# EAGLE schematic power (EAGLE 9.6.2)
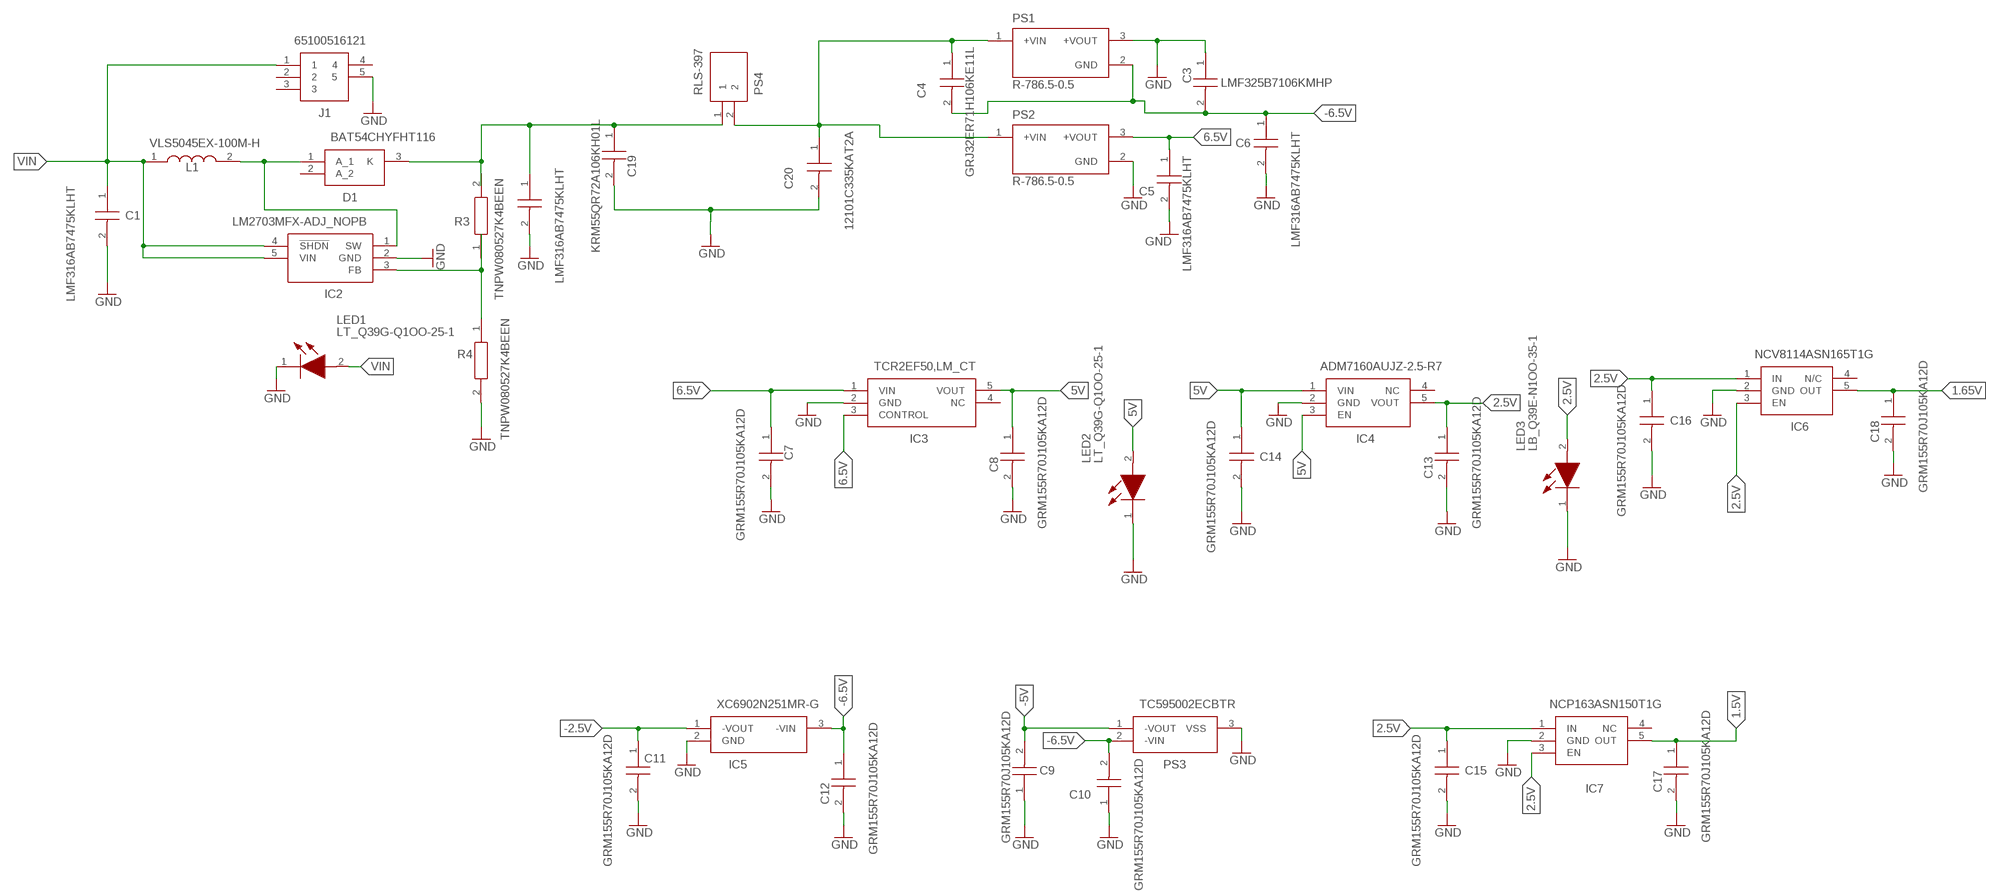
[diagram p0: schematic, sheet 1]

## Parts
C1  LMF316AB7475KLHT  [CAPC3216X180N]
C2  LMF316AB7475KLHT  [CAPC3216X180N]
C3  LMF325B7106KMHP  [CAPC3225X270N]
C4  GRJ32ER71H106KE11L  [CAPC3225X280N]
C5  LMF316AB7475KLHT  [CAPC3216X180N]
C6  LMF316AB7475KLHT  [CAPC3216X180N]
C7  GRM155R70J105KA12D  [CAPC1005X55N]
C8  GRM155R70J105KA12D  [CAPC1005X55N]
C9  GRM155R70J105KA12D  [CAPC1005X55N]
C10  GRM155R70J105KA12D  [CAPC1005X55N]
C11  GRM155R70J105KA12D  [CAPC1005X55N]
C12  GRM155R70J105KA12D  [CAPC1005X55N]
C13  GRM155R70J105KA12D  [CAPC1005X55N]
C14  GRM155R70J105KA12D  [CAPC1005X55N]
C15  GRM155R70J105KA12D  [CAPC1005X55N]
C16  GRM155R70J105KA12D  [CAPC1005X55N]
C17  GRM155R70J105KA12D  [CAPC1005X55N]
C18  GRM155R70J105KA12D  [CAPC1005X55N]
C19  KRM55QR72A106KH01L  [CAPC6153X390N]
C20  12101C335KAT2A  [CAPC3325X279N]
D1  BAT54CHYFHT116  [SOT95P240X115-3N]
IC2  LM2703MFX-ADJ_NOPB  [SOT95P280X145-5N]
IC3  TCR2EF50,LM_CT  [TCR2EF50LMCT]
IC4  ADM7160AUJZ-2.5-R7  [SOT95P280X100-5N]
IC5  XC6902N251MR-G  [SOT95P280X130-3N]
IC6  NCV8114ASN165T1G  [SOT95P275X110-5N]
IC7  NCP163ASN150T1G  [SOT95P280X145-5N]
J1  65100516121  [65100516121]
L1  VLS5045EX-100M-H  [VLS5045EX330M]
LED1  LT_Q39G-Q1OO-25-1  [LEDC1608X40N]
LED2  LT_Q39G-Q1OO-25-1  [LEDC1608X40N]
LED3  LB_Q39E-N1OO-35-1  [LEDC1608X40N]
PS1  R-786.5-0.5  [CONV_R-786.5-0.5]
PS2  R-786.5-0.5  [CONV_R-786.5-0.5]
PS3  TC595002ECBTR  [SOT95P275X130-3N]
PS4  RLS-397  [RLS397]
R3  TNPW080527K4BEEN  [RESC2012X55N]
R4  TNPW080527K4BEEN  [RESC2012X55N]

## Nets
1.5V: C17.1 IC7.5(OUT)
1.65V: C18.1 IC6.5(OUT)
2.5V: C13.1 C15.1 C16.1 IC4.5(VOUT) IC6.1(IN) IC6.3(EN) IC7.1(IN) IC7.3(EN) LED3.2(A)
5V: C8.1 C14.1 IC3.5(VOUT) IC4.1(VIN) IC4.3(EN) LED2.2(A)
6.5V: C5.1 C7.1 IC3.1(VIN) IC3.3(CONTROL) PS2.3(+VOUT)
-2.5V: C11.1 IC5.1(-VOUT)
-5V: C9.2 PS3.1(-VOUT)
-6.5V: C3.2 C4.2 C6.1 C10.2 C12.1 IC5.3(-VIN) PS1.2(GND) PS3.2(-VIN)
GND: C1.2 C2.2 C3.1 C5.2 C6.2 C7.2 C8.2 C9.1 C10.1 C11.2 C12.2 C13.2 C14.2 C15.2 C16.2 C17.2 C18.2 C19.2 C20.2 IC2.2(GND) IC3.2(GND) IC4.2(GND) IC5.2(GND) IC6.2(GND) IC7.2(GND) J1.5 LED1.1(K) LED2.1(K) LED3.1(K) PS1.3(+VOUT) PS2.2(GND) PS3.3(VSS) R4.2
IN: C2.1 C19.1 D1.3(K) PS4.1 R3.2
N$2: IC2.3(FB) R3.1 R4.1
N$7: C4.1 C20.1 PS1.1(+VIN) PS2.1(+VIN) PS4.2
N$8: D1.1(A_1) IC2.1(SW) L1.2
VIN: C1.1 IC2.4(!SHDN) IC2.5(VIN) J1.1 L1.1 LED1.2(A)
Unconnected: D1.2(A_2) IC3.4(NC) IC4.4(NC) IC6.4(N/C) IC7.4(NC) J1.2 J1.3 J1.4

## Library data of the parts
C1 C2 C5 C6 = SamacSys_Parts:LMF316AB7475KLHT: Multilayer Ceramic Capacitors MLCC - SMD/SMT 1206 10VDC 4.7uF 10% X7R AEC-Q200 Source: Datasheet <https://4donline.ihs.com/images/VipMasterIC/IC/TAIY/TAIY-S-A0014577573/TAIY-S-A0014577337-1.pdf?hkey=EF798316E3902B6ED9A73243A3159BB0>; DESCRIPTION: Multilayer Ceramic Capacitors MLCC - SMD/SMT 1206 10VDC 4.7uF 10% X7R AEC-Q200; HEIGHT: 1.8mm; MANUFACTURER_NAME: TAIYO YUDEN; MANUFACTURER_PART_NUMBER: LMF316AB7475KLHT; MOUSER_PART_NUMBER: 963-LMF316AB7475KLHT; MOUSER_PRICE-STOCK: https://www.mouser.co.uk/ProductDetail/Taiyo-Yuden/LMF316AB7475KLHT?qs=%252B6g0mu59x7Jucp0YIcNtlw%3D%3D
C3 = SamacSys_Parts:LMF325B7106KMHP: Multilayer Ceramic Capacitors MLCC - SMD/SMT 1210 10VDC 10uF 10% X7R AEC-Q200 Source: Datasheet <https://4donline.ihs.com/images/VipMasterIC/IC/TAIY/TAIY-S-A0010497038/TAIY-S-A0010490867-1.pdf?hkey=6D3A4C79FDBF58556ACFDE234799DDF0>; DESCRIPTION: Multilayer Ceramic Capacitors MLCC - SMD/SMT 1210 10VDC 10uF 10% X7R AEC-Q200; HEIGHT: 2.7mm; MANUFACTURER_NAME: TAIYO YUDEN; MANUFACTURER_PART_NUMBER: LMF325B7106KMHP; MOUSER_PART_NUMBER: 963-LMF325B7106KMHP; MOUSER_PRICE-STOCK: https://www.mouser.co.uk/ProductDetail/Taiyo-Yuden/LMF325B7106KMHP?qs=W%2FMpXkg%252BdQ7tCScIXneZ%2FA%3D%3D
C4 = SamacSys_Parts:GRJ32ER71H106KE11L: Cap Ceramic 10uF 50V X7R 10% Pad SMD 1210 Soft Termination 125C T/R Source: Datasheet <https://componentsearchengine.com/Datasheets/1/GRJ32ER71H106KE11L.pdf>; ARROW_PART_NUMBER: GRJ32ER71H106KE11L; ARROW_PRICE-STOCK: https://www.arrow.com/en/products/grj32er71h106ke11l/murata-manufacturing?region=nac; DESCRIPTION: Cap Ceramic 10uF 50V X7R 10% Pad SMD 1210 Soft Termination 125C T/R; HEIGHT: 2.8mm; MANUFACTURER_NAME: Murata Electronics; MANUFACTURER_PART_NUMBER: GRJ32ER71H106KE11L; MOUSER_PART_NUMBER: 81-GRJ32ER71H106KE1L; MOUSER_PRICE-STOCK: https://www.mouser.co.uk/ProductDetail/Murata-Electronics/GRJ32ER71H106KE11L?qs=Mkt%2FZhxPIiRCGrZ4HFiKZA%3D%3D
C7-C18 = SamacSys_Parts:GRM155R70J105KA12D: Multilayer Ceramic Capacitors MLCC - SMD/SMT 0402 1.0uF 6.3volts *Derate Voltage/Temp Source: Datasheet <https://psearch.en.murata.com/capacitor/product/GRM155R70J105KA12#.html>; ARROW_PART_NUMBER: GRM155R70J105KA12D; ARROW_PRICE-STOCK: https://www.arrow.com/en/products/grm155r70j105ka12d/murata-manufacturing?region=nac; DESCRIPTION: Multilayer Ceramic Capacitors MLCC - SMD/SMT 0402 1.0uF 6.3volts *Derate Voltage/Temp; HEIGHT: 0.55mm; MANUFACTURER_NAME: Murata Electronics; MANUFACTURER_PART_NUMBER: GRM155R70J105KA12D; MOUSER_PART_NUMBER: 81-GRM155R70J105KA2D; MOUSER_PRICE-STOCK: https://www.mouser.co.uk/ProductDetail/Murata-Electronics/GRM155R70J105KA12D?qs=OXzh9Ga2KBHWfvlODrgZnQ%3D%3D
C19 = SamacSys_Parts:KRM55QR72A106KH01L: Multilayer Ceramic Capacitors MLCC - SMD/SMT Source: Datasheet <https://psearch.en.murata.com/capacitor/product/KRM55QR72A106KH01#.html>; ARROW_PART_NUMBER: KRM55QR72A106KH01L; ARROW_PRICE-STOCK: https://www.arrow.com/en/products/krm55qr72a106kh01l/murata-manufacturing?region=nac; DESCRIPTION: Multilayer Ceramic Capacitors MLCC - SMD/SMT; HEIGHT: 3.9mm; MANUFACTURER_NAME: Murata Electronics; MANUFACTURER_PART_NUMBER: KRM55QR72A106KH01L; MOUSER_PART_NUMBER: 81-KRM55QR72A106KH1L; MOUSER_PRICE-STOCK: https://www.mouser.co.uk/ProductDetail/Murata-Electronics/KRM55QR72A106KH01L?qs=qkDYIeTQ%252BElto0fJu%2F86Vw%3D%3D
C20 = SamacSys_Parts:12101C335KAT2A: Multilayer Ceramic Capacitors MLCC - SMD/SMT 100V 3.3uF X7R 1210 10% Source: Datasheet <https://componentsearchengine.com/Datasheets/2/12101C335KAT2A.pdf>; DESCRIPTION: Multilayer Ceramic Capacitors MLCC - SMD/SMT 100V 3.3uF X7R 1210 10%; HEIGHT: 2.79mm; MANUFACTURER_NAME: AVX; MANUFACTURER_PART_NUMBER: 12101C335KAT2A; MOUSER_PART_NUMBER: 581-12101C335KAT2A; MOUSER_PRICE-STOCK: https://www.mouser.co.uk/ProductDetail/AVX/12101C335KAT2A?qs=t3bE0qb%2FqELbFuOKr%2F10pA%3D%3D
D1 = SamacSys_Parts:BAT54CHYFHT116: Schottky Diodes & Rectifiers SCHOTTKY BARRIER DIODE Source: Datasheet <https://4donline.ihs.com/images/VipMasterIC/IC/ROHM/ROHM-S-A0010595071/ROHM-S-A0010666907-1.pdf?hkey=EF798316E3902B6ED9A73243A3159BB0>; DESCRIPTION: Schottky Diodes & Rectifiers SCHOTTKY BARRIER DIODE; HEIGHT: 1.15mm; MANUFACTURER_NAME: ROHM Semiconductor; MANUFACTURER_PART_NUMBER: BAT54CHYFHT116; MOUSER_PART_NUMBER: 755-BAT54CHYFHT116; MOUSER_PRICE-STOCK: https://www.mouser.co.uk/ProductDetail/ROHM-Semiconductor/BAT54CHYFHT116?qs=QNEnbhJQKvbxVoFekP9UeQ%3D%3D
IC2 = SamacSys_Parts:LM2703MFX-ADJ_NOPB: Micropower Step-Up DC/DC Converter with 350mA Peak Current Limit Source: Datasheet <http://www.ti.com/lit/gpn/lm2703>; ARROW_PART_NUMBER: LM2703MFX-ADJ/NOPB; ARROW_PRICE-STOCK: https://www.arrow.com/en/products/lm2703mfx-adjnopb/texas-instruments; DESCRIPTION: Micropower Step-Up DC/DC Converter with 350mA Peak Current Limit; HEIGHT: 1.45mm; MANUFACTURER_NAME: Texas Instruments; MANUFACTURER_PART_NUMBER: LM2703MFX-ADJ/NOPB; MOUSER_PART_NUMBER: 926-LM2703MFXADJNOPB; MOUSER_PRICE-STOCK: https://www.mouser.com/Search/Refine.aspx?Keyword=926-LM2703MFXADJNOPB
IC3 = SamacSys_Parts:TCR2EF50,LM_CT: LDO Voltage Regulators 200mA LDO, Vout=5.0V, Dropout=180mV, Iq=35uA, PSRR=73dB, in SOT-25 (SMV) package Source: Datasheet <https://toshiba.semicon-storage.com/info/docget.jsp?did=13794&prodName=TCR2EF50>; DESCRIPTION: LDO Voltage Regulators 200mA LDO, Vout=5.0V, Dropout=180mV, Iq=35uA, PSRR=73dB, in SOT-25 (SMV) package; HEIGHT: 1.4mm; MANUFACTURER_NAME: Toshiba; MANUFACTURER_PART_NUMBER: TCR2EF50,LM(CT; MOUSER_PART_NUMBER: 757-TCR2EF50LMCT; MOUSER_PRICE-STOCK: https://www.mouser.co.uk/ProductDetail/Toshiba/TCR2EF50LMCT?qs=bZr6mbWTK5m4vMduq2OXCA%3D%3D
IC4 = SamacSys_Parts:ADM7160AUJZ-2.5-R7: LDO Voltage Regulators 200mA LDO 25Vout Source: Datasheet <https://componentsearchengine.com/Datasheets/1/ADM7160AUJZ-2.5-R7.pdf>; DESCRIPTION: LDO Voltage Regulators 200mA LDO 25Vout; HEIGHT: 1mm; MANUFACTURER_NAME: Linear Technology; MANUFACTURER_PART_NUMBER: ADM7160AUJZ-2.5-R7; MOUSER_PART_NUMBER: 584-ADM7160AUJZ2.5R7; MOUSER_PRICE-STOCK: https://www.mouser.com/Search/Refine.aspx?Keyword=584-ADM7160AUJZ2.5R7
IC5 = SamacSys_Parts:XC6902N251MR-G: LDO Voltage Regulators Source: Datasheet <http://www.mouser.com/ds/2/760/XC6902-846637.pdf>; DESCRIPTION: LDO Voltage Regulators; HEIGHT: 1.3mm; MANUFACTURER_NAME: Torex; MANUFACTURER_PART_NUMBER: XC6902N251MR-G; MOUSER_PART_NUMBER: 865-XC6902N251MR-G; MOUSER_PRICE-STOCK: https://www.mouser.co.uk/ProductDetail/Torex-Semiconductor/XC6902N251MR-G/?qs=AsjdqWjXhJ97TLkuQPXWBQ%3D%3D
IC6 = SamacSys_Parts:NCV8114ASN165T1G: ONSEMI - NCV8114ASN165T1G - LDO REGULATOR, 300 MA, LOW IQ 1.65V AD Source: Datasheet <https://www.onsemi.com/pub/Collateral/NCV8114-D.PDF>; ARROW_PART_NUMBER: NCV8114ASN165T1G; ARROW_PRICE-STOCK: https://www.arrow.com/en/products/ncv8114asn165t1g/on-semiconductor?region=nac; DESCRIPTION: ONSEMI - NCV8114ASN165T1G - LDO REGULATOR, 300 MA, LOW IQ 1.65V AD; HEIGHT: 1.1mm; MANUFACTURER_NAME: ON Semiconductor; MANUFACTURER_PART_NUMBER: NCV8114ASN165T1G; MOUSER_PART_NUMBER: 863-NCV8114ASN165T1G; MOUSER_PRICE-STOCK: https://www.mouser.co.uk/ProductDetail/onsemi/NCV8114ASN165T1G?qs=PqoDHHvF64%252BWMsY7A2HF3Q%3D%3D
IC7 = SamacSys_Parts:NCP163ASN150T1G: ONSEMI - NCP163ASN150T1G - LDO Voltage Regulator, Fixed, 2.2 V to 5.5 V in, 1.5 V / 250 mA out, SOT23-5 Source: Datasheet <https://www.onsemi.com/pdf/datasheet/ncp163-d.pdf>; DESCRIPTION: ONSEMI - NCP163ASN150T1G - LDO Voltage Regulator, Fixed, 2.2 V to 5.5 V in, 1.5 V / 250 mA out, SOT23-5; HEIGHT: 1.45mm; MANUFACTURER_NAME: ON Semiconductor; MANUFACTURER_PART_NUMBER: NCP163ASN150T1G; MOUSER_PART_NUMBER: 863-NCP163ASN150T1G; MOUSER_PRICE-STOCK: https://www.mouser.co.uk/ProductDetail/onsemi/NCP163ASN150T1G?qs=vLWxofP3U2x6R82l9MbdEQ%3D%3D
J1 = SamacSys_Parts:65100516121: WR-COM USB Connector Mini horizontal SMD Wurth Elektronik WR-COM Series Right Angle SMT Type B Mini USB Connector Receptacle, 30 V ac, 1A Source: Datasheet <http://www.farnell.com/datasheets/2157009.pdf>; DESCRIPTION: WR-COM USB Connector Mini horizontal SMD Wurth Elektronik WR-COM Series Right Angle SMT Type B Mini USB Connector Receptacle, 30 V ac, 1A; HEIGHT: mm; MANUFACTURER_NAME: Wurth Elektronik; MANUFACTURER_PART_NUMBER: 65100516121; MOUSER_PART_NUMBER: 710-65100516121; MOUSER_PRICE-STOCK: https://www.mouser.co.uk/ProductDetail/Wurth-Elektronik/65100516121?qs=rS3zZhy2AQPLyCguT204Og%3D%3D
L1 = SamacSys_Parts:VLS5045EX-100M-H: SMD / SMT Inductors (Coils), L=10?H, L x W x T : Source: Datasheet <https://product.tdk.com/system/files/dam/doc/product/inductor/inductor/smd/catalog/inductor_automotive_power_vls5045ex-h_en.pdf>; ARROW_PART_NUMBER: VLS5045EX-100M-H; ARROW_PRICE-STOCK: https://www.arrow.com/en/products/vls5045ex-100m-h/tdk; DESCRIPTION: SMD / SMT Inductors (Coils), L=10?H, L x W x T :; HEIGHT: 4mm; MANUFACTURER_NAME: TDK; MANUFACTURER_PART_NUMBER: VLS5045EX-100M-H; MOUSER_PART_NUMBER: 810-VLS5045EX-100M-H; MOUSER_PRICE-STOCK: https://www.mouser.co.uk/ProductDetail/TDK/VLS5045EX-100M-H?qs=EBDBlbfErPxDDKYBGzjLDg%3D%3D
LED1 LED2 = SamacSys_Parts:LT_Q39G-Q1OO-25-1: 2.85 V Green LED 1608 (0603) SMD,Osram Opto CHIPLED 0603 LT Q39G-Q1OO-25-1 Source: Datasheet <https://datasheet.datasheetarchive.com/originals/distributors/DKDS41/DSANUWW0036591.pdf>; DESCRIPTION: 2.85 V Green LED 1608 (0603) SMD,Osram Opto CHIPLED 0603 LT Q39G-Q1OO-25-1; HEIGHT: 0.4mm; MANUFACTURER_NAME: OSRAM; MANUFACTURER_PART_NUMBER: LT Q39G-Q1OO-25-1; MOUSER_PART_NUMBER: 720-LTQ39GQ1S22515; MOUSER_PRICE-STOCK: https://www.mouser.co.uk/ProductDetail/OSRAM-Opto-Semiconductors/LT-Q39G-Q1OO-25-1?qs=74fRo9GAWszgXtz8D2kVhg%3D%3D
LED3 = SamacSys_Parts:LB_Q39E-N1OO-35-1: Standard LEDs - SMD Blue 470nm Source: Datasheet <https://componentsearchengine.com/Datasheets/1/LB Q39E-N1OO-35-1.pdf>; DESCRIPTION: Standard LEDs - SMD Blue 470nm; HEIGHT: 0.4mm; MANUFACTURER_NAME: OSRAM; MANUFACTURER_PART_NUMBER: LB Q39E-N1OO-35-1; MOUSER_PART_NUMBER: 720-LBQ39EN1P1351; MOUSER_PRICE-STOCK: https://www.mouser.co.uk/ProductDetail/OSRAM-Opto-Semiconductors/LB-Q39E-N1OO-35-1?qs=74fRo9GAWsyCe%2Fcwa%2FhbPA%3D%3D
PS1 PS2 = R-786.5-0.5:R-786.5-0.5: 0.5 Amp SIP3 Single Output; DESCRIPTION: 0.5A DC/DC-Converter 'INNOLINE' SIP3 reg; DIGI-KEY_PART_NUMBER: 945-1039-ND; MF: Recom Power; MP: R-786.5-0.5; PACKAGE: SIP-3 Recom Power; PURCHASE-URL: https://pricing.snapeda.com/search/part/R-786.5-0.5/?ref=eda
PS3 = SamacSys_Parts:TC595002ECBTR: 100mA -5V LDO Negative Regulator SOT-23A Microchip TC595002ECBTR, LDO Voltage Regulator, 100mA, Source: Datasheet <https://datasheet.datasheetarchive.com/originals/distributors/Datasheets-303/39564.pdf>; ARROW_PART_NUMBER: TC595002ECBTR; ARROW_PRICE-STOCK: https://www.arrow.com/en/products/tc595002ecbtr/microchip-technology; DESCRIPTION: 100mA -5V LDO Negative Regulator SOT-23A Microchip TC595002ECBTR, LDO Voltage Regulator, 100mA,; HEIGHT: 1.3mm; MANUFACTURER_NAME: Microchip; MANUFACTURER_PART_NUMBER: TC595002ECBTR; MOUSER_PART_NUMBER: 579-TC595002ECBTR; MOUSER_PRICE-STOCK: https://www.mouser.co.uk/ProductDetail/Microchip-Technology/TC595002ECBTR?qs=n%2FfJlMG9rCbPVifAtUx8yQ%3D%3D
PS4 = SamacSys_Parts:RLS-397: Inductor Power Unshielded Wirewound 3.9uH 20% 100KHz 1.32A 0.14Ohm DCR 1812 Bag Source: Datasheet <https://recom-power.com/pdf/Accessories/RLS-397.pdf>; DESCRIPTION: Inductor Power Unshielded Wirewound 3.9uH 20% 100KHz 1.32A 0.14Ohm DCR 1812 Bag; HEIGHT: 3.1mm; MANUFACTURER_NAME: RECOM Power; MANUFACTURER_PART_NUMBER: RLS-397; MOUSER_PART_NUMBER: 919-RLS-397; MOUSER_PRICE-STOCK: https://www.mouser.co.uk/ProductDetail/RECOM-Power/RLS-397?qs=gZXFycFWdAMzj7SWZ0VCrw%3D%3D
R3 R4 = SamacSys_Parts:TNPW080527K4BEEN: Thin Film Resistors - SMD 27.4Kohms .1% 25ppm Source: Datasheet; DESCRIPTION: Thin Film Resistors - SMD 27.4Kohms .1% 25ppm; HEIGHT: 0.55mm; MANUFACTURER_NAME: Vishay; MANUFACTURER_PART_NUMBER: TNPW080527K4BEEN; MOUSER_PART_NUMBER: 71-TNPW080527K4BEEN; MOUSER_PRICE-STOCK: https://www.mouser.co.uk/ProductDetail/Vishay-Dale/TNPW080527K4BEEN?qs=hgbOVb73YtioxFqgMNH98g%3D%3D